# EAGLE schematic Motor Controller test PCB (EAGLE 9.3.0)
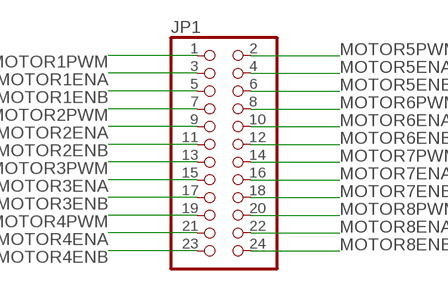
[diagram p0: schematic, sheet 1]

## Parts
JP1  PINHD-2X12  [2X12]

## Nets
MOTOR1ENA: JP1.3
MOTOR1ENB: JP1.5
MOTOR1PWM: JP1.1
MOTOR2ENA: JP1.9
MOTOR2ENB: JP1.11
MOTOR2PWM: JP1.7
MOTOR3ENA: JP1.15
MOTOR3ENB: JP1.17
MOTOR3PWM: JP1.13
MOTOR4ENA: JP1.21
MOTOR4ENB: JP1.23
MOTOR4PWM: JP1.19
MOTOR5ENA: JP1.4
MOTOR5ENB: JP1.6
MOTOR5PWM: JP1.2
MOTOR6ENA: JP1.10
MOTOR6ENB: JP1.12
MOTOR6PWM: JP1.8
MOTOR7ENA: JP1.16
MOTOR7ENB: JP1.18
MOTOR7PWM: JP1.14
MOTOR8ENA: JP1.22
MOTOR8ENB: JP1.24
MOTOR8PWM: JP1.20

## Library data of the parts
JP1 = pinhead:PINHD-2X12: PIN HEADER